# Altium schematic sheet Motor Control.SchDoc
size A
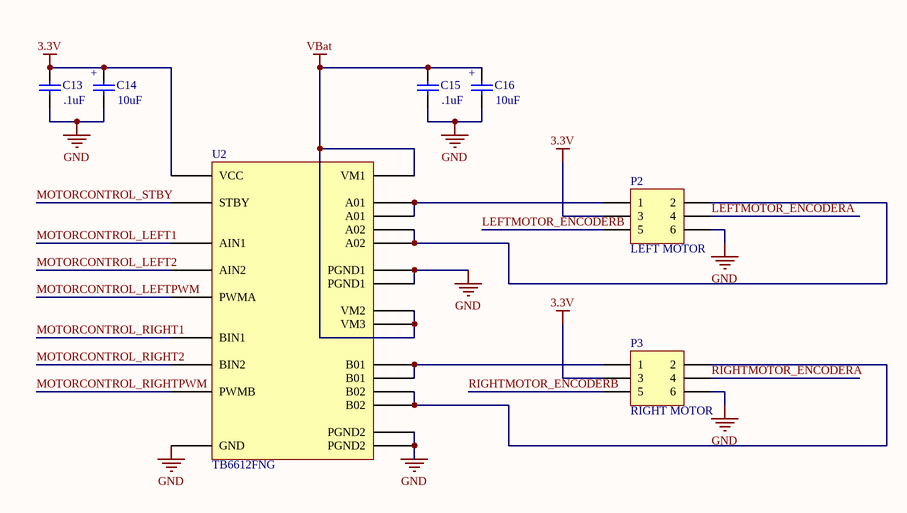
[diagram p0: Motor Control.SchDoc]

## Parts
C13  value .1uF  [1608[0603]]  (hidden comment: Cap Semi)
C14  value 10uF  [1608[0603]]  (hidden comment: Cap Semi)
C15  value .1uF  [1608[0603]]  (hidden comment: Cap Semi)
C16  value 10uF  [C1210]  (hidden comment: Cap Semi)
P2  LEFT MOTOR  [HDR2X3]
P3  RIGHT MOTOR  [HDR2X3]
U2  TB6612FNG  [SSOP24-P-300-0.65A]

## Nets
3.3V: C13.2 C14.2 P2.3 P3.3 U2.20(VCC)
GND: C13.1 C14.1 C15.1 C16.1 P2.6 P3.6 U2.3(PGND1) U2.4(PGND1) U2.9(PGND2) U2.10(PGND2) U2.18(GND)
VBat: C15.2 C16.2 U2.13(VM2) U2.14(VM3) U2.24(VM1)
LEFTMOTOR_ENCODERA: P2.4
LEFTMOTOR_ENCODERB: P2.5
MOTORCONTROL_LEFT1: U2.21(AIN1)
MOTORCONTROL_LEFT2: U2.22(AIN2)
MOTORCONTROL_LEFTPWM: U2.23(PWMA)
MOTORCONTROL_RIGHT1: U2.17(BIN1)
MOTORCONTROL_RIGHT2: U2.16(BIN2)
MOTORCONTROL_RIGHTPWM: U2.15(PWMB)
MOTORCONTROL_STBY: U2.19(STBY)
RIGHTMOTOR_ENCODERA: P3.4
RIGHTMOTOR_ENCODERB: P3.5
NetP2_1: P2.1 U2.1(A01) U2.2(A01)
NetP2_2: P2.2 U2.5(A02) U2.6(A02)
NetP3_1: P3.1 U2.11(B01) U2.12(B01)
NetP3_2: P3.2 U2.7(B02) U2.8(B02)

## Notes on the sheet
- (near C14) +
- (near C16) +

## Library data of the parts
C13-C16 = Cap Semi: Capacitor (Semiconductor SIM Model); Published: 8-Jun-2000; LatestRevisionDate: 29-May-2009; LatestRevisionNote: IPC-7351 Footprint Added.; PackageReference: C1206; Publisher: Altium Limited; PackageDescription: Chip Capacitor
P2 P3 = Header 3X2: Header, 3-Pin, Dual row; LatestRevisionDate: 17-Jul-2002; LatestRevisionNote: Re-released for DXP Platform.; Publisher: Altium Limited
U2 = TB6612FNG: Vendor Part No.: TB6612FNG(OC8EL)CT-ND; Manufacturer: Toshiba; Vendor: Digikey; Manufacturer Part No: TB6612FNG